# Altium schematic sheet Solar.SchDoc: Dual Harvester
size Letter; Author: Ali Saffari; Organization: University of Washington; Address1: Sensor Systems Lab; SheetNumber: 1; SheetTotal: 3
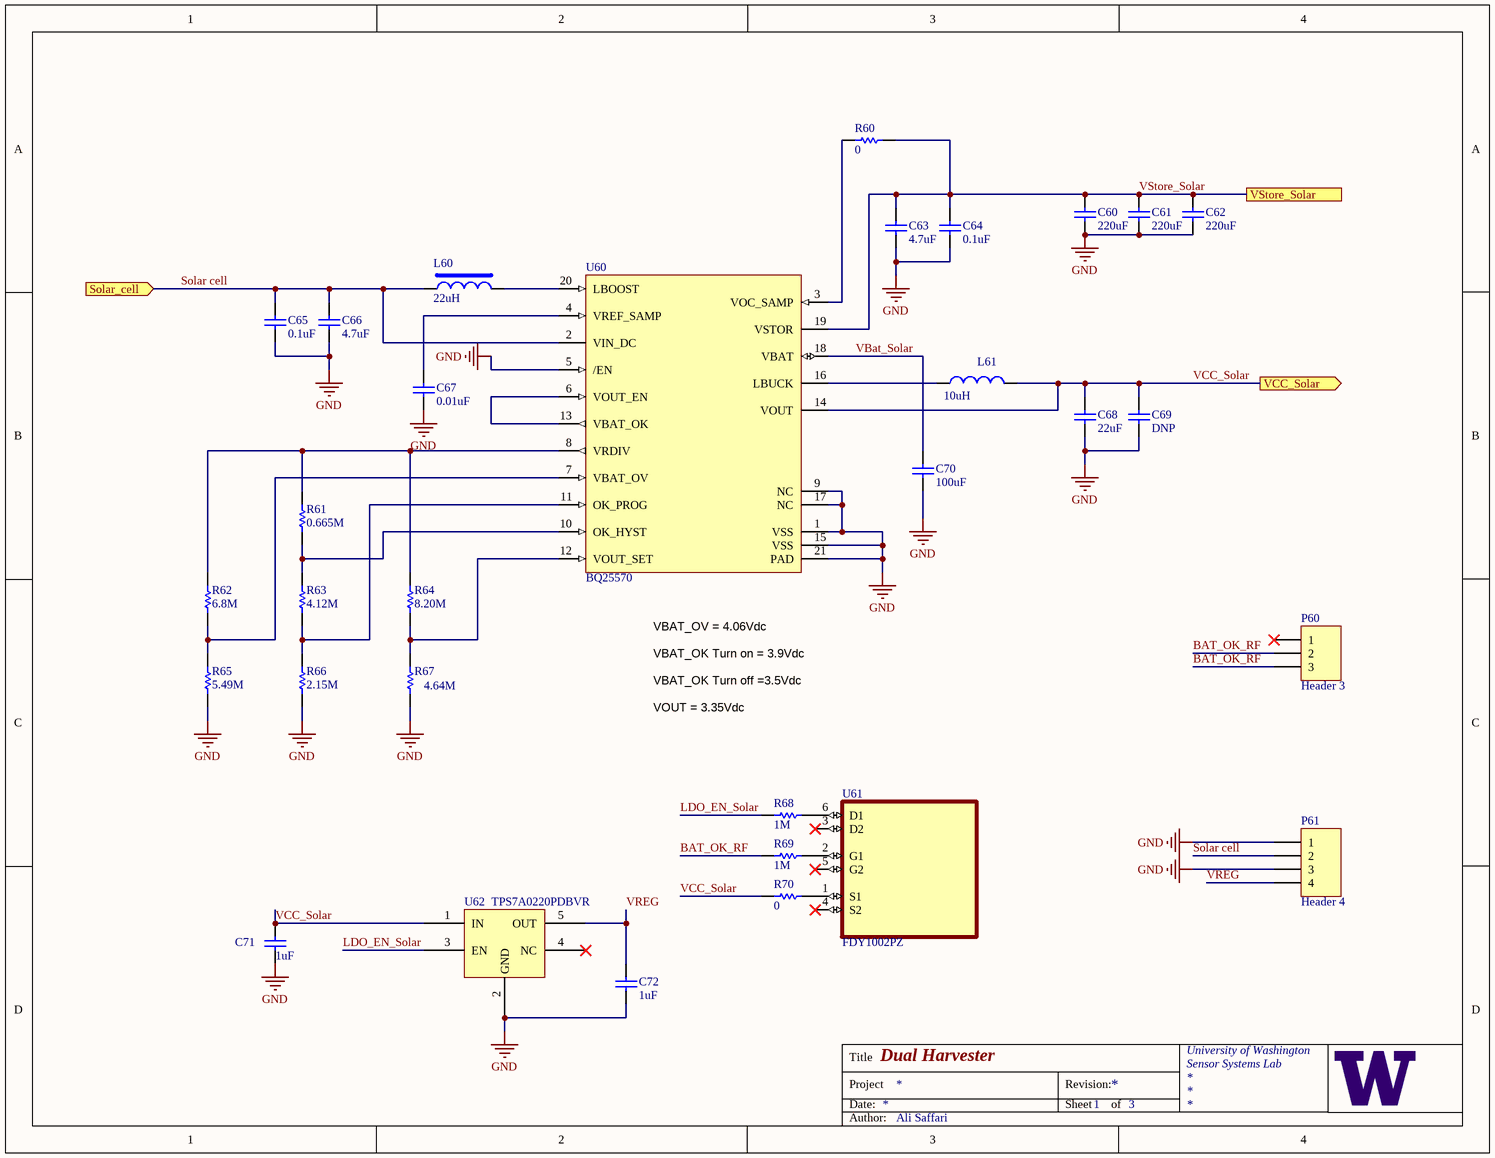
[diagram p0: Solar.SchDoc]

## Parts
C60  220uF  [1206]
C61  220uF  [1206]
C62  220uF  [1206]
C63  4.7uF  [0402]
C64  0.1uF  [0402]
C65  0.1uF  [0402]
C66  4.7uF  [0402]
C67  0.01uF  [0402]
C68  22uF  [0402]
C69  DNP  [0402]
C70  100uF  [0805]
C71  value 1uF  [0402]  (hidden comment: Cap)
C72  value 1uF  [0402]  (hidden comment: Cap)
L60  value 22uH  [LPS4018]  (hidden comment: Ind_LPS4018)
L61  10uH  [IND1008]
P60  Header 3  [HDR1X3]
P61  Header 4  [HDR1X4]
R60  0  [0402]
R61  0.665M  [0402]
R62  6.8M  [0402]
R63  4.12M  [0402]
R64  8.20M  [0402]
R65  5.49M  [0402]
R66  2.15M  [0402]
R67  4.64M  [0402]
R68  1M  [0402]
R69  1M  [0402]
R70  0  [0402]
U60  BQ25570  [BQ25570]
U61  FDY1002PZ  [SOT50P160X60-6N]
U62  TPS7A0220PDBVR  [SOT23-5]

## Ports
Solar_cell (in), VCC_Solar (out), VStore_Solar

## Nets
GND: C60.1 C61.1 C62.1 C63.1 C64.1 C65.1 C66.1 C67.1 C68.1 C69.1 C70.1 C71.1 C72.1 P61.1 P61.3 R65.2 R66.2 R67.2 U60.1(VSS) U60.5(/EN) U60.9(NC) U60.15(VSS) U60.17(NC) U60.21(PAD) U62.2(GND)
BAT_OK_RF: P60.2 P60.3 R69.1
LDO_EN_Solar: R68.1 U62.3(EN)
Solar cell: C65.2 C66.2 L60.1 P61.2 U60.2(VIN_DC) ; port Solar_cell
VBat_Solar: C70.2 U60.18(VBAT)
VCC_Solar: C68.2 C69.2 C71.2 L61.2 R70.1 U60.14(VOUT) U62.1(IN) ; port VCC_Solar
VREG: C72.2 P61.4 U62.5(OUT)
VStore_Solar: C60.2 C61.2 C62.2 C63.2 C64.2 R60.2 U60.19(VSTOR) ; port VStore_Solar
NetC67_2: C67.2 U60.4(VREF_SAMP)
NetL60_2: L60.2 U60.20(LBOOST)
NetL61_1: L61.1 U60.16(LBUCK)
NetR60_1: R60.1 U60.3(VOC_SAMP)
NetR61_1: R61.1 R62.1 R64.1 U60.8(VRDIV)
NetR61_2: R61.2 R63.1 U60.10(OK_HYST)
NetR62_2: R62.2 R65.1 U60.7(VBAT_OV)
NetR63_2: R63.2 R66.1 U60.11(OK_PROG)
NetR64_2: R64.2 R67.1 U60.12(VOUT_SET)
NetR68_2: R68.2 U61.6(D1)
NetR69_2: R69.2 U61.2(G1)
NetR70_2: R70.2 U61.1(S1)
NetU60_6: U60.6(VOUT_EN) U60.13(VBAT_OK)

Not connected (* = marked no-connect by the designer): P60 1*; U61 3(D2)* 4(S2)* 5(G2)*; U62 4(NC)*

## Notes on the sheet
- VBAT_OV = 4.06Vdc
- VBAT_OK Turn on = 3.9Vdc
- VBAT_OK Turn off =3.5Vdc
- VOUT = 3.35Vdc
- Title
- Date:
- Project
- Revision:
- Sheet
- of
- Author:

## Library data of the parts
C60-C62 = Cap: Ceramic Capacitor (Surface Mount); Manufacturer: Murata Electronics; Manufacturer Part Number: GRM31CR60J227ME11L; Rating: 6.3V; Note: CAP CER 220UF 6.3V X5R 1206; Digi-Key Part Number: 490-13970-1-ND; Value: 220uF
C63 C66 C67 = Cap: Ceramic Capacitor (Surface Mount); Manufacturer: Murata Electronics; Manufacturer Part Number: GRM155R61A475MEAAD; Rating: 10V; Note: CAP CER 4.7UF 10V X5R 0402; Digi-Key Part Number: 490-14306-1-ND
  C63 C66: Value: 4.7uF
  C67: Value: 0.01uF
C64 C65 = Cap: Ceramic Capacitor (Surface Mount); Manufacturer: Murata Electronics North America; Manufacturer Part Number: GCM155R71C104KA55D; Rating: 16V; Note: CAP CER 0.1UF 16V X7R 0402; Digi-Key Part Number: 490-4759-1-ND; Value: 0.1uF
C68 C69 = Cap: Ceramic Capacitor (Surface Mount); Manufacturer: Murata Electronics; Manufacturer Part Number: GRM188R61A226ME15D; Rating: 10V; Note: CAP CER 22UF 10V X5R 0603; Digi-Key Part Number: 490-10476-1-ND
  C68: Value: 22uF
  C69: Value: DNP
C70 = Cap: Ceramic Capacitor (Surface Mount); Manufacturer: Murata Electronics; Manufacturer Part Number: GRM21BR60J107ME15L; Rating: 6.3V; Note: CAP CER 100UF 6.3V X5R 0805; Digi-Key Part Number: 490-13981-1-ND; Value: 100uF
C71 C72 = Cap: Ceramic Capacitor (Surface Mount); Manufacturer: Generic Ceramic Chip Cap (TBD); Digi-Key Part Number: *; Manufacturer Part Number: *; Note: *; Rating: *
L60 = Ind_LPS4018: Inductor (Surface Mount); Manufacturer: Coil Craft; Manufacturer Part Number: LPS4018-223MRB; Rating: 0.9A; Note: LPS4018 Low Profile 22uH 0.9A 20% SMD; Digi-Key Part Number: *
L61 = Ind: Inductor (Surface Mount); Manufacturer: Murata Electronics; Manufacturer Part Number: 1239AS-H-100M=P2; Rating: 1A; Note: FIXED IND 10UH 1A 460 MOHM SMD; Value: 10uH; Digi-Key Part Number: 490-10563-1-ND
P60 = Header 3: Header, 3-Pin; LatestRevisionDate: 17-Jul-2002; LatestRevisionNote: Re-released for DXP Platform.; Publisher: Altium Limited
P61 = Header 4: Header, 4-Pin; LatestRevisionDate: 17-Jul-2002; LatestRevisionNote: Re-released for DXP Platform.; Publisher: Altium Limited
R60 R68-R70 = Res: Chip Resistor (Surface Mount); Manufacturer: Yageo; Manufacturer Part Number: RC0402JR-070RL; Rating: 1/16W; Digi-Key Part Number: 311-0.0JRCT-ND
  R60 R70: Value: 0
  R68 R69: Value: 1M
R61 = Res: Chip Resistor (Surface Mount); Manufacturer: Yageo; Manufacturer Part Number: RC0402FR-073M3L; Rating: 1/16W; Digi-Key Part Number: 311-3.30MLRCT-ND; Value: 0.665M
R62 R64 = Res: Chip Resistor (Surface Mount); Manufacturer: Vishay Dale; Manufacturer Part Number: CRCW04026M80JNED; Rating: 1/16W; Digi-Key Part Number: 541-6.8MJCT-ND
  R62: Value: 6.8M
  R64: Value: 8.20M
R63 R65 R67 = Res: Chip Resistor (Surface Mount); Manufacturer: Vishay Dale; Manufacturer Part Number: CRCW04025M49FKED; Rating: 1/16W; Digi-Key Part Number: 541-5.49MLCT-ND
  R63: Value: 4.12M
  R65: Value: 5.49M
  R67: Value: 4.64M
R66 = Res: Chip Resistor (Surface Mount); Manufacturer: Vishay Dale; Manufacturer Part Number: CRCW04024M22FKED; Rating: 1/16W; Digi-Key Part Number: 541-4.22MLCT-ND; Value: 2.15M
U60 = BQ25570: nano power boost charger and buck converter / for energy harvester powered applications; Manufacturer: Texas Instruments; Manufacturer Part Number: BQ25570RGRT; Output Current: 100mA; Operating Supply Current: 488nA; Min Supply Voltage: 100mV; Max Supply Voltage: 5.1V; Switching Frequency: 1MHz; Digi-Key Part Number: 296-37014-1-ND; Supplier 1: Digi-Key; Stock 1: 2223; Pricing 1: 1=7.94, 10=7.171, 25=6.8372, 100=5.6697 (USD); Mount: Surface Mount; Case/Package: VQFN; Number of Pins: 20; Contact Plating: Gold; Min Operating Temperature: -40°C; Max Operating Temperature: 125°C; Package Quantity: 250; Packaging: Tape and Reel; Radiation Hardening: No; REACH SVHC: No SVHC; Lead Free: Lead Free; ComponentLink1URL: http://www.mouser.com/ds/2/405/bq25570-556801.pdf?src-supplier=Mouser; ComponentLink1Description: http://www.mouser.com/ds/2/405/bq25570-556801.pdf?src-supplier=Mouser; ComponentLink2URL: http://www.ti.com/lit/pdf/sluuaa7?src-supplier=Digi-Key; ComponentLink2Description: http://www.ti.com/lit/pdf/sluuaa7?src-supplier=Digi-Key; ComponentLink3URL: http://www.farnell.com/datasheets/1904809.pdf?src-supplier=Element14; ComponentLink3Description: http://www.farnell.com/datasheets/1904809.pdf?src-supplier=Element14; ComponentLink4URL: http://www.ti.com/lit/ds/symlink/bq25570.pdf?src-supplier=Digi-Key; ComponentLink4Description: http://www.ti.com/lit/ds/symlink/bq25570.pdf?src-supplier=Digi-Key; ComponentLink5URL: http://www.ti.com/lit/ds/symlink/bq25570.pdf?src-supplier=Avnet; ComponentLink5Description: http://www.ti.com/lit/ds/symlink/bq25570.pdf?src-supplier=Avnet; ComponentLink6URL: http://www.ti.com/general/docs/lit/getliterature.tsp?genericPartNumber=BQ25570&&fileType=pdf&src-supplier=Avnet; ComponentLink6Description: http://www.ti.com/general/docs/lit/getliterature.tsp?genericPartNumber=BQ25570&&fileType=pdf&src-supplier=Avnet; Supplier Part Number 1: 296-37014-1-ND
U61 = FDY1002PZ: Mosfet Array 2 P-Channel (Dual) 20V 830mA 446mW Surface Mount SOT-563F; MF: ON Semiconductor; Value: *; Check_prices: https://www.snapeda.com/parts/FDY1002PZ/Onsemi/view-part/?ref=eda; Availability: In Stock; Price: None; MP: FDY1002PZ; Package: SOT-563-6 ON Semiconductor; SnapEDA_Link: https://www.snapeda.com/parts/FDY1002PZ/Onsemi/view-part/?ref=snap; Purchase-URL: https://pricing.snapeda.com/search/part/FDY1002PZ/?ref=eda
U62 = TPS7A0218PDBVR: IC REG LINEAR 2V 200MA SOT23-5